# Altium schematic sheet v2-DCSupplyHub-outputs.SchDoc
size A4; SheetNumber: 4; SheetTotal: 5
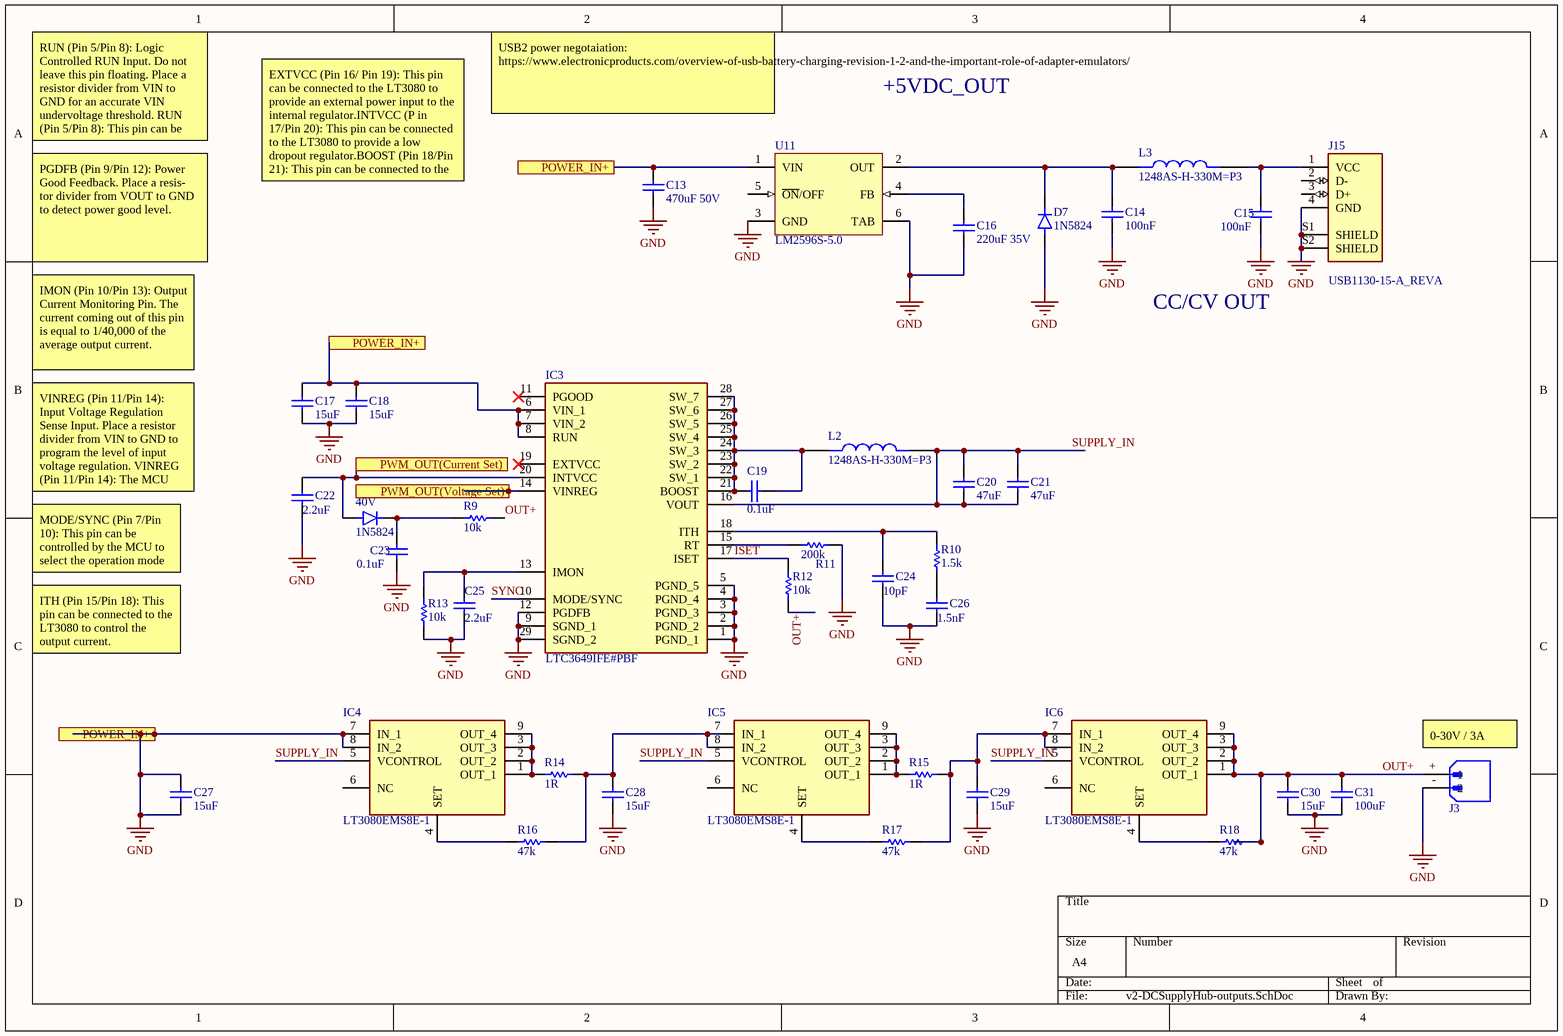
[diagram p0: v2-DCSupplyHub-outputs.SchDoc]

## Parts
40V  1N5824  [DIOAD1898W129L762D1143]
C13  Cap  [CAPC3216X110N]  (value not drawn)
C14  value 100nF  [CAPC3216X110N]  (hidden comment: Cap)
C15  value 100nF  [CAPC3216X110N]  (hidden comment: Cap)
C16  Cap  [CAPC3216X110N]  (value not drawn)
C17  value 15uF  [CAPC3216X110N]  (hidden comment: Cap)
C18  value 15uF  [CAPC3216X110N]  (hidden comment: Cap)
C19  value 0.1uF  [CAPC3216X110N]  (hidden comment: Cap)
C20  value 47uF  [CAPC3216X110N]  (hidden comment: Cap)
C21  value 47uF  [CAPC3216X110N]  (hidden comment: Cap)
C22  value 2.2uF  [CAPC3216X110N]  (hidden comment: Cap)
C23  value 0.1uF  [CAPC3216X110N]  (hidden comment: Cap)
C24  value 10pF  [CAPC3216X110N]  (hidden comment: Cap)
C25  value 2.2uF  [CAPC3216X110N]  (hidden comment: Cap)
C26  value 1.5nF  [CAPC3216X110N]  (hidden comment: Cap)
C27  value 15uF  [CAPC3216X110N]  (hidden comment: Cap)
C28  value 15uF  [CAPC3216X110N]  (hidden comment: Cap)
C29  value 15uF  [CAPC3216X110N]  (hidden comment: Cap)
C30  value 15uF  [CAPC3216X110N]  (hidden comment: Cap)
C31  value 100uF  [CAPC3216X110N]  (hidden comment: Cap)
D7  1N5824  [DIOAD1898W129L762D1143]
IC3  LTC3649IFE#PBF  [SOP65P640X120-29N]
IC4  LT3080EMS8E-1  [SOP65P490X110-9N]  (value not drawn)
IC5  LT3080EMS8E-1  [SOP65P490X110-9N]  (value not drawn)
IC6  LT3080EMS8E-1  [SOP65P490X110-9N]  (value not drawn)
J3  B2B-XH-A(LF)(SN)  [JST_B2B-XH-A(LF)(SN)]  (value not drawn)
J15  USB1130-15-A_REVA  [GCT_USB1130-15-A_REVA]
L2  1248AS-H-330M=P3  [IND_1248AS-H-330M=P3]
L3  1248AS-H-330M=P3  [IND_1248AS-H-330M=P3]
R9  value 10k  [RESC3116X60N]  (hidden comment: Res1)
R10  value 1.5k  [RESC3116X60N]  (hidden comment: Res1)
R11  value 200k  [RESC3116X60N]  (hidden comment: Res1)
R12  value 10k  [RESC3116X60N]  (hidden comment: Res1)
R13  value 10k  [RESC3116X60N]  (hidden comment: Res1)
R14  value 1R  [RESC3116X60N]  (hidden comment: Res1)
R15  value 1R  [RESC3116X60N]  (hidden comment: Res1)
R16  value 47k  [RESC3116X60N]  (hidden comment: Res1)
R17  value 47k  [RESC3116X60N]  (hidden comment: Res1)
R18  value 47k  [RESC3116X60N]  (hidden comment: Res1)
U11  LM2596S-5.0  [KTT0005B_L]

## Ports
POWER_IN+, PWM_OUT(Current Set), PWM_OUT(Voltage Set)

## Nets
GND: C13.1 C13.2 C14.2 C15.2 C16.1 C17.1 C17.2 C18.1 C18.2 C22.2 C23.2 C24.2 C25.1 C26.2 C27.1 C27.2 C28.2 C29.2 C30.2 C31.2 D7.A IC3.1(PGND_1) IC3.2(PGND_2) IC3.3(PGND_3) IC3.4(PGND_4) IC3.5(PGND_5) IC3.6(VIN_1) IC3.7(VIN_2) IC3.8(RUN) IC3.9(SGND_1) IC3.12(PGDFB) IC3.29(SGND_2) IC4.7(IN_1) IC4.8(IN_2) J3.-(2) J15.4(GND) J15.S1(SHIELD) J15.S2(SHIELD) R11.1 R13.1 U11.1(VIN) U11.3(GND) U11.6(TAB) ; port POWER_IN+
ISET: IC3.17(ISET) R12.2
OUT+: C30.1 C31.1 IC6.1(OUT_1) IC6.2(OUT_2) IC6.3(OUT_3) IC6.9(OUT_4) J3.+(1) R9.1 R12.1 R18.2
PWM_OUT(Current Set): 40V.A C22.1 IC3.20(INTVCC) ; port PWM_OUT(Current Set)
PWM_OUT(Voltage Set): IC3.14(VINREG) ; port PWM_OUT(Voltage Set)
SUPPLY_IN: C20.1 C20.2 C21.1 C21.2 IC3.16(VOUT) IC4.5(VCONTROL) IC5.5(VCONTROL) IC6.5(VCONTROL) L2.2
SYNC: IC3.10(MODE/SYNC)
Net40V_C: 40V.C(K) C23.1 R9.2
NetC14_1: C14.1 D7.C(K) L3.1 U11.2(OUT)
NetC15_1: C15.1 J15.1(VCC) L3.2
NetC16_2: C16.2 U11.4(FB)
NetC19_1: C19.1 C19.2 IC3.21(BOOST) IC3.22(SW_1) IC3.23(SW_2) IC3.24(SW_3) IC3.25(SW_4) IC3.26(SW_5) IC3.27(SW_6) IC3.28(SW_7) L2.1
NetC24_1: C24.1 IC3.18(ITH) R10.2
NetC25_2: C25.2 IC3.13(IMON) R13.2
NetC26_1: C26.1 R10.1
NetC28_1: C28.1 IC5.7(IN_1) IC5.8(IN_2) R14.2 R16.2
NetC29_1: C29.1 IC6.7(IN_1) IC6.8(IN_2) R15.2 R17.2
NetIC3_15: IC3.15(RT) R11.2
NetIC4_1: IC4.1(OUT_1) IC4.2(OUT_2) IC4.3(OUT_3) IC4.9(OUT_4) R14.1
NetIC4_4: IC4.4(SET) R16.1
NetIC5_1: IC5.1(OUT_1) IC5.2(OUT_2) IC5.3(OUT_3) IC5.9(OUT_4) R15.1
NetIC5_4: IC5.4(SET) R17.1
NetIC6_4: IC6.4(SET) R18.1

Not connected (* = marked no-connect by the designer): IC3 11(PGOOD)* 19(EXTVCC)*; IC4 6(NC); IC5 6(NC); IC6 6(NC); J15 2(D-) 3(D+); U11 5(~{ON}/OFF)

## Notes on the sheet
- USB2 power negotaiation: https://www.electronicproducts.com/overview-of-usb-battery-charging-revision-1-2-and-the-important-role-of-adapter-emulators/
- +5VDC_OUT
- RUN (Pin 5/Pin 8): Logic Controlled RUN Input. Do not leave this pin floating. Place a resistor divider from VIN to GND for an accurate VIN undervoltage threshold. RUN (Pin 5/Pin 8): This pin can be controlled by the MCU to enable or disable the LTC3694.
- EXTVCC (Pin 16/ Pin 19): This pin can be connected to the LT3080 to  provide an external power input to the internal regulator.INTVCC (P in 17/Pin 20): This pin can be connected to the LT3080 to provide a low dropout regulator.BOOST (Pin 18/Pin 21): This pin can be connected to the LT3080 to prov ide a boosted floating driver supply for the internal top power MOSFET.SW (Pins 19-25/Pins 22-28): These pins can be connected to the LT3080 to  provide the switch node connection to the inductor of the step-down regulator.
- PGDFB (Pin 9/Pin 12): Power Good Feedback. Place a resis- tor divider from VOUT to GND to detect power good level.
- CC/CV OUT
- IMON (Pin 10/Pin 13): Output Current Monitoring Pin. The current coming out of this pin is equal to 1/40,000 of the average output current.
- VINREG (Pin 11/Pin 14): Input Voltage Regulation Sense Input. Place a resistor divider from VIN to GND to program the level of input voltage regulation. VINREG (Pin 11/Pin 14): The MCU can use this pin to program the level of input voltage regulation.
- MODE/SYNC (Pin 7/Pin 10): This pin can be controlled by the MCU to select the operation mode of the LTC3694 or to synchronize the internal oscillator with an external clock signal
- ITH (Pin 15/Pin 18): This pin can be connected to the LT3080 to control the output current.
- (near J3) 0-30V / 3A
- (in symbol Cap) 470uF 50V; 220uF 35V

## Library data of the parts
40V D7 = 1N5824: Diode Schottky 30V 5A Through Hole Axial; MF: Microsemi Corporation; Value: *; SnapEDA_Link: https://www.snapeda.com/parts/1N5824/Microsemi%20Corporation/view-part/49055/?ref=snap; MP: 1N5824; Availability: Unavailable; Price: None; Package: Axial Microsemi
C13-C31 = Cap: Capacitor; Published: 8-Jun-2000; LatestRevisionDate: 17-Jul-2002; LatestRevisionNote: Re-released for DXP Platform.; PackageReference: RAD-0.3; Publisher: Altium Limited; PackageDescription: Radial Cap, Thru-Hole; 2 Leads; 0.3 in Pin Spacing
IC3 = LTC3649IFE#PBF: LINEAR TECHNOLOGY - LTC3649IFE#PBF - DC/DC CONV, SYNC BUCK, 1MHZ, TSSOP-28; Manufacturer_Name: Analog Devices; Geometry.Height: 1.2mm; Datasheet Link: http://www.analog.com/media/en/technical-documentation/data-sheets/3649fb.pdf; Manufacturer_Part_Number: LTC3649IFE#PBF; Mouser Part Number: 584-LTC3649IFE#PBF; Mouser Price/Stock: https://www.mouser.co.uk/ProductDetail/Analog-Devices/LTC3649IFEPBF?qs=oahfZPh6IALghjzowGYuFA%3D%3D; Arrow Part Number: LTC3649IFE#PBF; Arrow Price/Stock: https://www.arrow.com/en/products/ltc3649ifepbf/linear-technology; Supplier 1: Digi-Key; Supplier Part Number 1: LTC3649IFE#PBF-ND
IC4-IC6 = LT3080EMS8E-1: Integrated Circuit; Manufacturer_Name: Analog Devices; Height: 1.1mm; Manufacturer_Part_Number: LT3080EMS8E-1; Arrow Part Number: LT3080EMS8E-1; Arrow Price/Stock: https://www.arrow.com/en/products/lt3080ems8e-1/analog-devices?region=nac
  IC4: Datasheet Link: https://www.analog.com/media/en/technical-documentation/data-sheets/3080fc.pdf
  IC5 IC6: Datasheet Link: https://www.arrow.com/en/products/lt3080ems8e-1/analog-devices
J3 = B2B-XH-A(LF)(SN): Connector Header Through Hole 2 position 0.098 (2.50mm); MF: JST Sales; SnapEDA_Link: https://www.snapeda.com/parts/B2B-XH-A(LF)(SN)/JST+Sales+America+Inc./view-part/?ref=snap; Package: None; Value: *; MP: B2B-XH-A(LF)(SN); Check_prices: https://www.snapeda.com/parts/B2B-XH-A(LF)(SN)/JST+Sales+America+Inc./view-part/?ref=eda
J15 = USB1130-15-A_REVA: USB 2.0 Connector Full size Horizontal Plug, type A, 4 Pins, Through hole, Top mount, 6.99mm profile, High mating cycle, charging receptacle; MF: Global Connector Technology; Price: None; Availability: In Stock; Package: None; MP: USB1130-15-A; Value: *; SnapEDA_Link: https://www.snapeda.com/parts/USB1130-15-A/Global+Connector+Technology/view-part/?ref=snap; Purchase-URL: https://pricing.snapeda.com/search/part/USB1130-15-A/?ref=eda; Check_prices: https://www.snapeda.com/parts/USB1130-15-A/Global+Connector+Technology/view-part/?ref=eda
L2 L3 = 1248AS-H-330M=P3: Inductor with Inductance: 33uH Tol. +/-20%, Package: 3131 _8080_; MF: Murata; Digi-Key_Purchase_URL: https://www.digikey.com/product-detail/en/murata-electronics/1248AS-H-330M=P3/490-10797-1-ND/5271539?utm_source=snapeda&utm_medium=aggregator&utm_campaign=symbol; Digi-Key_Part_Number: 490-10797-1-ND; MP: 1248AS-H-330M=P3; Value: *; SnapEDA_Link: https://www.snapeda.com/parts/1248AS-H-330M%3DP3/Murata/view-part/4548511/?ref=snap; Package: - Murata
R9-R18 = Res1: Resistor; Published: 8-Jun-2000; LatestRevisionDate: 17-Jul-2002; LatestRevisionNote: Re-released for DXP Platform.; PackageReference: AXIAL-0.3; Publisher: Altium Limited; PackageDescription: Axial Device, Thru-Hole; 2 Leads; 0.3 in Pin Spacing
U11 = CMP-0069-00270-3: SIMPLE SWITCHER® Power Converter 150 KHz 3A Step-Down Voltage Regulator, 5-pin TO-263; Manufacturer: Texas Instruments; PowerWise: N; PackageTopMarking: NSUZXYTTE#*LM2596S*-5.0 P+; RoHS: N; Code_JEDEC: MO-169-AB; PackageDescription: TO-263, Molded, .400 x .390 x .180in, 5 Lead, .067in Pitch, Surface Mount; PinCount: 5; PackageReference: KTT0005B; CompType: Switcher; ComponentLink1URL: http://www.ti.com/general/docs/lit/getliterature.tsp?genericPartNumber=LM2596&fileType=pdf; ComponentLink1Description: Datasheet URL